# EAGLE design board (EAGLE 9.6.2)
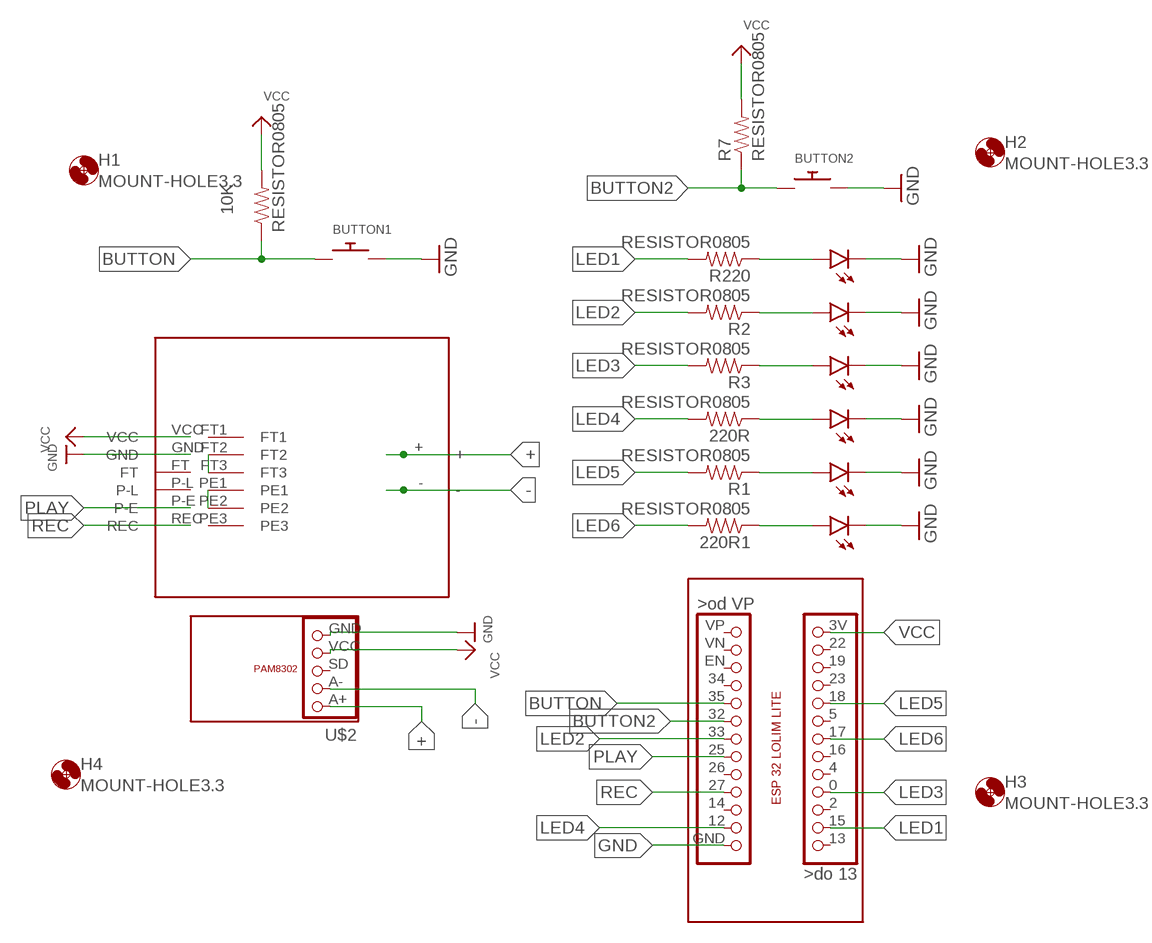
[diagram p0: schematic, sheet 1]

## Parts
10K  RESISTOR0805  [R0805]
220R  RESISTOR0805  [R0805]
220R1  RESISTOR0805  [R0805]
BUTTON1  SWITCH_PUSHBUTTONEVQ-PE  [TACT_PANA-EVQ]
BUTTON2  SWITCH_PUSHBUTTONEVQ-PE  [TACT_PANA-EVQ]
ESP32  NOWA-ESP32  [NOWA-ESP32]
H1  MOUNT-HOLE3.3  [3,3]
H2  MOUNT-HOLE3.3  [3,3]
H3  MOUNT-HOLE3.3  [3,3]
H4  MOUNT-HOLE3.3  [3,3]
LED1  LED5MM  [LED5MM]
LED2  LED5MM  [LED5MM]
LED3  LED5MM  [LED5MM]
LED4  LED5MM  [LED5MM]
LED5  LED5MM  [LED5MM]
LED6  LED5MM  [LED5MM]
R1  RESISTOR0805  [R0805]
R2  RESISTOR0805  [R0805]
R3  RESISTOR0805  [R0805]
R7  RESISTOR0805  [R0805]
R220  RESISTOR0805  [R0805]
U$2  NOWA-PAM8302  [NOWA-PAM8302]
U$7  NOWA-ISD1820  [NOWA-ISD1820]

## Nets
+: U$2.A+ U$7.+
-: U$2.A- U$7.-
BUTTON: 10K.1 BUTTON1.P$1 ESP32.35
BUTTON2: BUTTON2.P$1 ESP32.32 R7.1
GND: BUTTON1.P$2 BUTTON2.P$2 ESP32.GND LED1.K(C) LED2.K(C) LED3.K(C) LED4.K(C) LED5.K(C) LED6.K(C) U$2.GND U$7.GND
LED1: ESP32.15 R220.2
LED2: ESP32.33 R2.2
LED3: ESP32.0 R3.2
LED4: 220R.2 ESP32.12
LED5: ESP32.18 R1.2
LED6: 220R1.2 ESP32.17
N$1: LED5.A R1.1
N$2: 220R1.1 LED6.A
N$3: LED2.A R220.1
N$4: LED3.A R2.1
N$5: LED4.A R3.1
N$6: 220R.1 LED1.A
N$7: U$7.FT2 U$7.FT3
N$8: U$7.PE1 U$7.PE2
PLAY: ESP32.25 U$7.P-E
REC: ESP32.27 U$7.REC
VCC: 10K.2 ESP32.3V R7.2 U$2.VCC U$7.VCC
Unconnected: ESP32.2 ESP32.4 ESP32.5 ESP32.13 ESP32.14 ESP32.16 ESP32.19 ESP32.22 ESP32.23 ESP32.26 ESP32.34 ESP32.EN ESP32.VN ESP32.VP U$2.SD U$7.FT U$7.FT1 U$7.P-L U$7.PE3

## Library data of the parts
10K 220R 220R1 R1-R3 R7 R220 = BeagleBone_Blue_R3:RESISTOR
BUTTON1 BUTTON2 = adafruit:SWITCH_PUSHBUTTON: Buttons SOFTTOUCHSMD_SJ - Soft touch temporary push button (Super Junk Akihabara) Compatible with SKPMANE010 [Mouser: 688-SKPMAN] C&K_KSS = Digikey: KSS221GLFS
ESP32 = nowa-esp32:NOWA-ESP32
H1-H4 = holes:MOUNT-HOLE: MOUNTING HOLE with drill center marker
LED1-LED6 = led:LED: LED OSRAM: - CHIPLED LG R971, LG N971, LY N971, LG Q971, LY Q971, LO R971, LY R971 LH N974, LH R974 LS Q976, LO Q976, LY Q976 LO Q996 - Hyper CHIPLED LW Q18S LB Q993, LB Q99A, LB R99A - SideLED LS A670, LO A670, LY A670, LG A670, LP A670 LB A673, LV A673, LT A673, LW A673 LH A674 LY A675 LS A676, LA A676, LO A676, LY A676, LW A676 LS A679, LY A679, LG A679 - Hyper Micro SIDELED® LS Y876, LA Y876, LO Y876, LY Y876 LT Y87S - SmartLED LW L88C, LW L88S LB L89C, LB L89S, LG L890 LS L89K, LO L89K, LY L89K LS L896, LA L896, LO L896, LY L896 - TOPLED LS T670, LO T670, LY T670, LG T670, LP T670 LSG T670, LSP T670, LSY T670, LOP T670, LYG T670 LG T671, LOG T671, LSG T671 LB T673, LV T673, LT T673, LW T673 LH T674 LS T676, LA T676, LO T676, LY T676, LB T676, LH T676, LSB T676, LW T676 LB T67C, LV T67C, LT T67C, LS T67K, LO T67K, LY T67K, LW E67C LS E67B, LA E67B, LO E67B, LY E67B, LB E67C, LV E67C, LT E67C LW T67C LS T679, LY T679, LG T679 LS T770, LO T770, LY T770, LG T770, LP T770 LB T773, LV T773, LT T773, LW T773 LH T774 LS E675, LA E675, LY E675, LS T675 LS T776, LA T776, LO T776, LY T776, LB T776 LHGB T686 LT T68C, LB T68C - Hyper Mini TOPLED® LB M676 - Mini TOPLED Santana® LG M470 LS M47K, LO M47K, LY M47K Source: http://www.osram.convergy.de LUXEON: - LUMILED® LXK2-PW12-R00, LXK2-PW12-S00, LXK2-PW14-U00, LXK2-PW14-V00 LXK2-PM12-R00, LXK2-PM12-S00, LXK2-PM14-U00 LXK2-PE12-Q00, LXK2-PE12-R00, LXK2-PE12-S00, LXK2-PE14-T00, LXK2-PE14-U00 LXK2-PB12-K00, LXK2-PB12-L00, LXK2-PB12-M00, LXK2-PB14-N00, LXK2-PB14-P00, LXK2-PB14-Q00 LXK2-PR12-L00, LXK2-PR12-M00, LXK2-PR14-Q00, LXK2-PR14-R00 LXK2-PD12-Q00, LXK2-PD12-R00, LXK2-PD12-S00 LXK2-PH12-R00, LXK2-PH12-S00 LXK2-PL12-P00, LXK2-PL12-Q00, LXK2-PL12-R00 Source: www.luxeon.com KINGBRIGHT: KA-3528ASYC Source: www.kingbright.com
U$2 = nowa-PAM8302:NOWA-PAM8302
U$7 = nowa-isd1820:NOWA-ISD1820

## Board
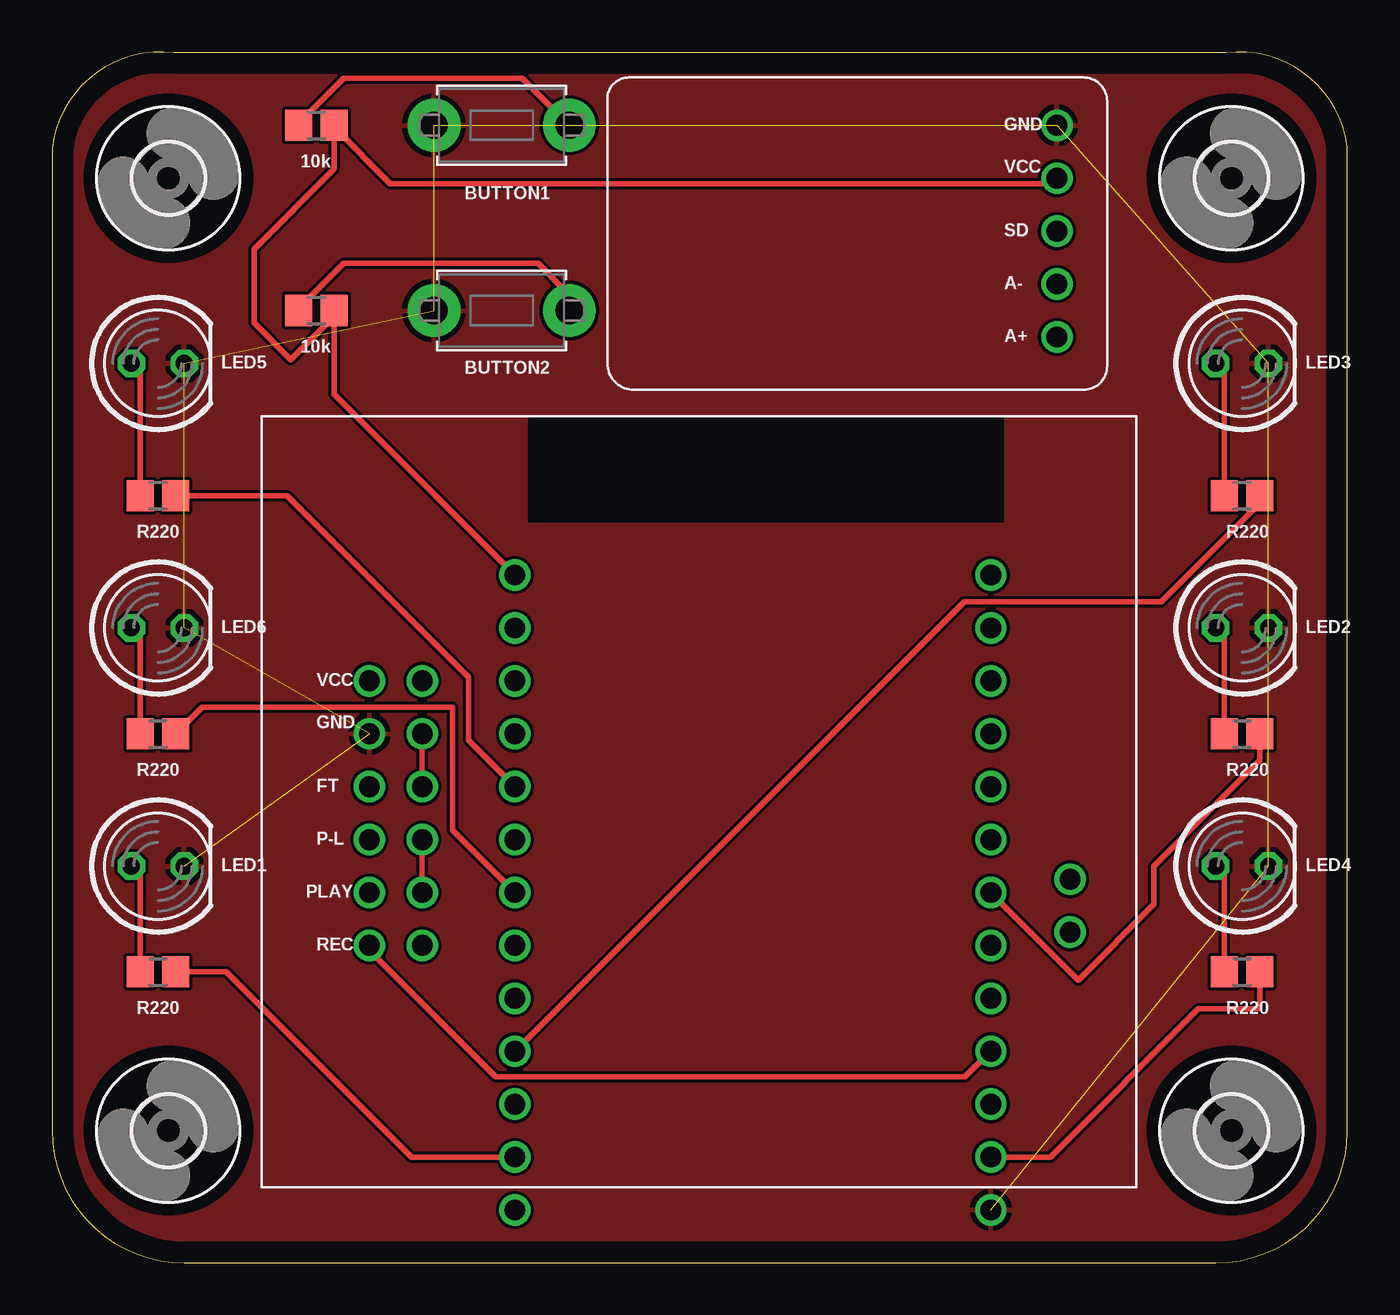
[diagram p1: board, top side]
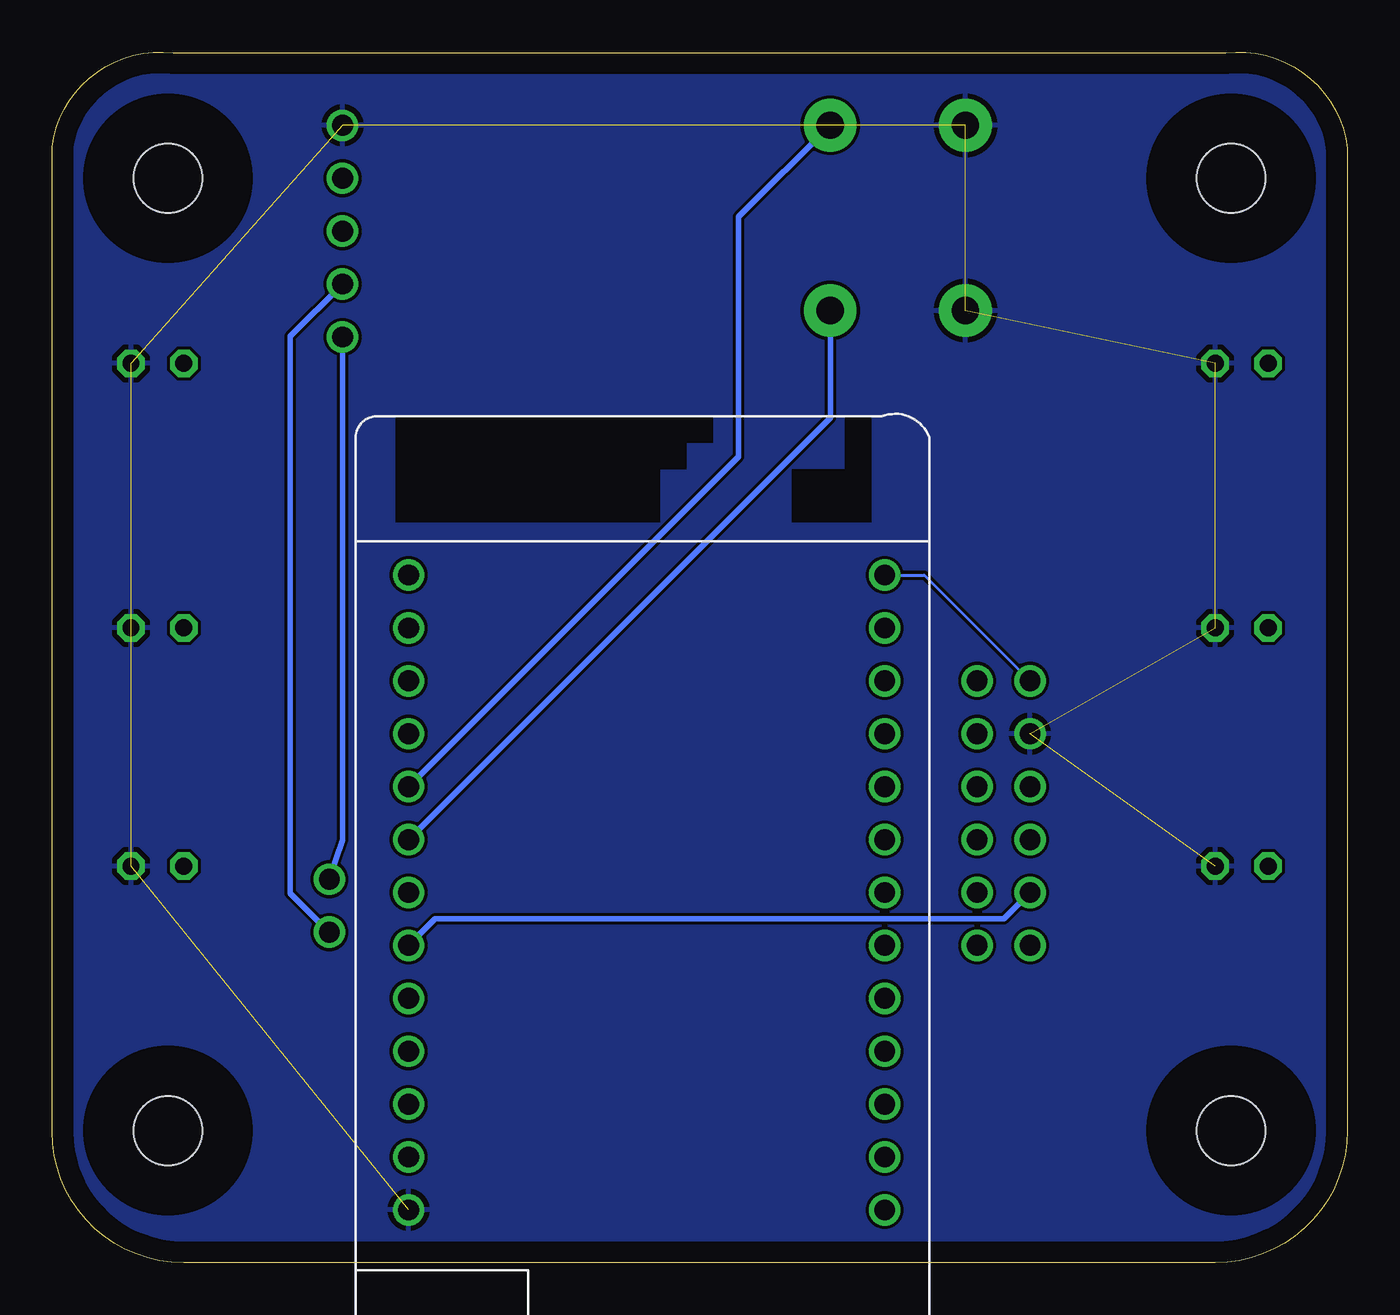
[diagram p2: board, bottom side, seen from below]

Size 62.21 x 58.13 mm. Coordinates in mm from the lower left corner, seen from the top.
Outline: 56.4,58.09 5.85,58.09 arc90 0,53.51 0,6.35 arc90 6.35,0 55.9,0 arc90 62.21,6.31 62.21,53.55 arc90 56.4,58.09
Copper layers (1*16): Top 0.035mm / dielectric 1.5mm / Bottom 0.035mm
Design rules "default": minimum track width 6mil, minimum drill 0.35mm, track to track 6mil, track to pad 6mil, pad to pad 6mil, via to via 6mil, smd to smd 6mil, copper to edge 40mil, drill to drill 6mil, minimum pad ring 10mil, minimum via ring 8mil, stop-mask expansion 4mil, vias tented up to drill 0mil, thermal gap 10mil
tRestrict: area 22.9,35.6 to 45.7,40.6
bRestrict: area 33,35.6 to 45.7,40.6; area 31.8,38.1 to 33,40.6; area 22.9,35.6 to 26.7,38.1; area 30.5,39.4 to 31.8,40.6; area 22.9,38.1 to 24.1,39.4; area 22.9,39.4 to 24.1,40.6

### Footprints (pad centres in the part's own frame; a part is rotated, then mirrored left to right if it is on the bottom)
R0805 = smd 1.3 x 1.5: 1 -0.85,0; 2 0.85,0
TACT_PANA-EVQ = drill 1.3 pad 2.54: P$1 -3.25,0; P$2 3.25,0
NOWA-ESP32 = drill 1: 0 10.16,10.16; 2 12.7,10.16; 3V -12.7,10.16; 4 7.62,10.16; 5 0,10.16; 12 15.24,-12.7; 13 17.78,10.16; 14 12.7,-12.7; 15 15.24,10.16; 16 5.08,10.16; 17 2.54,10.16; 18 -2.54,10.16; 19 -7.62,10.16; 22 -10.16,10.16; 23 -5.08,10.16; 25 5.08,-12.7; 26 7.62,-12.7; 27 10.16,-12.7; 32 0,-12.7; 33 2.54,-12.7; 34 -5.08,-12.7; 35 -2.54,-12.7; EN -7.62,-12.7; GND 17.78,-12.7; VN -10.16,-12.7; VP -12.7,-12.7
3,3 = hole 3.3: 0,0
LED5MM = drill 0.813 octagon: A -1.27,0; K 1.27,0
NOWA-PAM8302 = drill 1: A+ 10.16,-2.54; A- 10.16,0; GND 10.16,7.62; SD 10.16,2.54; VCC 10.16,5.08
NOWA-ISD1820 = drill 1: + 38.735,14.605; - 38.735,12.065; FT 5.08,19.05; FT1 7.62,24.13; FT2 7.62,21.59; FT3 7.62,19.05; GND 5.08,21.59; P-E 5.08,13.97; P-L 5.08,16.51; PE1 7.62,16.51; PE2 7.62,13.97; PE3 7.62,11.43; REC 5.08,11.43; VCC 5.08,24.13

### Placement (x,y rotation side)
10K  12.7,54.61 0 top
220R  57.15,13.97 0 top
220R1  5.08,25.4 0 top
BUTTON1  21.59,54.61 180 top
BUTTON2  21.59,45.72 180 top
ESP32  32.38,20.32 270 bottom
H1  56.64,52.07 0 top
H2  5.59,52.07 0 top
H3  56.64,6.35 0 top
H4  5.59,6.35 0 top
LED1  57.15,19.05 0 top
LED2  5.08,19.05 0 top
LED3  57.15,30.48 0 top
LED4  57.15,43.18 0 top
LED5  5.08,43.18 0 top
LED6  5.08,30.48 0 top
R1  5.08,36.83 0 top
R2  57.15,25.4 0 top
R3  57.15,36.83 0 top
R7  12.7,45.72 0 top
R220  5.08,13.97 0 top
U$2  38.1,46.99 0 top
U$7  10.16,3.81 0 top

### Tracks (layer width: path | path; a pad name or v marks a point on that pad's centre or on a via)
+
  Bottom 0.254: U$7.+ 48.26,20.32 U$2.A+
-
  Bottom 0.254: U$7.- 50.77,17.75 50.77,44.48 U$2.A-
BUTTON
  Top 0.152: 10K.1 11.85,54.71
  Top 0.254: 11.85,54.71 14.01,56.87 22.58,56.87 BUTTON1.P$1
  Bottom 0.254: ESP32.35 29.24,38.7 29.24,50.21 BUTTON1.P$1
BUTTON2
  Top 0.152: R7.1 11.85,45.82
  Top 0.254: 11.85,45.82 14.01,47.98 23.34,47.98 24.84,46.48 BUTTON2.P$1
  Bottom 0.254: ESP32.32 24.84,40.56 BUTTON2.P$1
GND  (10 unrouted)
  pour Bottom: -3.81,62.23 62.23,62.23 66.04,58.42 66.04,-5.08 64.77,-6.35 2.54,-6.35 -1.27,-2.54 -3.81,0
  pour Top: -7.62,63.5 62.23,63.5 68.58,57.15 68.58,-1.27 63.5,-6.35 -3.81,-6.35 -3.81,59.69
LED1
  Top 0.254: ESP32.15 17.26,5.08 8.37,13.97 R220.2
LED2
  Top 0.254: ESP32.33 49.29,13.58 52.92,17.21 52.92,19.05 58,24.13 R2.2
LED3
  Top 0.254: ESP32.0 43.81,31.75 53.27,31.75 58,36.48 R3.2
LED4
  Top 0.254: ESP32.12 47.94,5.08 55.05,12.19 58,12.19 220R.2
LED5
  Top 0.254: ESP32.18 20,25.08 20,28.12 11.3,36.83 R1.2
LED6
  Top 0.254: ESP32.17 19.24,20.77 19.24,26.67 7.2,26.67 220R1.2
N$1
  Top 0.254: R1.1 4.23,42.76 LED5.A
N$2
  Top 0.254: 220R1.1 4.23,30.06 LED6.A
N$3
  Top 0.254: R220.1 4.23,18.63 LED2.A
N$4
  Top 0.254: LED3.A 56.3,30.06 R2.1
N$5
  Top 0.254: LED4.A 56.3,42.76 R3.1
N$6
  Top 0.254: 220R.1 56.3,18.63 LED1.A
N$7
  Top 0.254: U$7.FT3 U$7.FT2
N$8
  Top 0.254: U$7.PE1 U$7.PE2
PLAY
  Bottom 0.254: U$7.P-E 16.51,16.51 43.81,16.51 ESP32.25
REC
  Top 0.254: U$7.REC 15.24,14.99 21.3,8.92 43.85,8.92 ESP32.27
VCC
  Top 0.152: 13.55,54.51 10K.2
  Top 0.254: U$2.VCC 48.01,51.82 16.24,51.82 13.55,54.51 | ESP32.3V 13.55,41.7 R7.2 13.55,45.44 11.47,43.36 9.7,45.13 9.7,48.67 13.55,52.52 10K.2
  Bottom 0.152: ESP32.3V 20.32,33.02 U$7.VCC

### Text on the board
tPlace: GND | 10k | VCC | BUTTON1 | SD | A- | 10k | A+ | LED5 | BUTTON2 | LED3 | R220 | R220 | LED6 | LED2 | VCC | GND | R220 | FT | R220 | P-L | LED1 | LED4 | PLAY | REC | R220 | R220